# Altium schematic sheet DebugOutputs.SchDoc
size OrCAD A; SheetNumber: 2; SheetTotal: 3
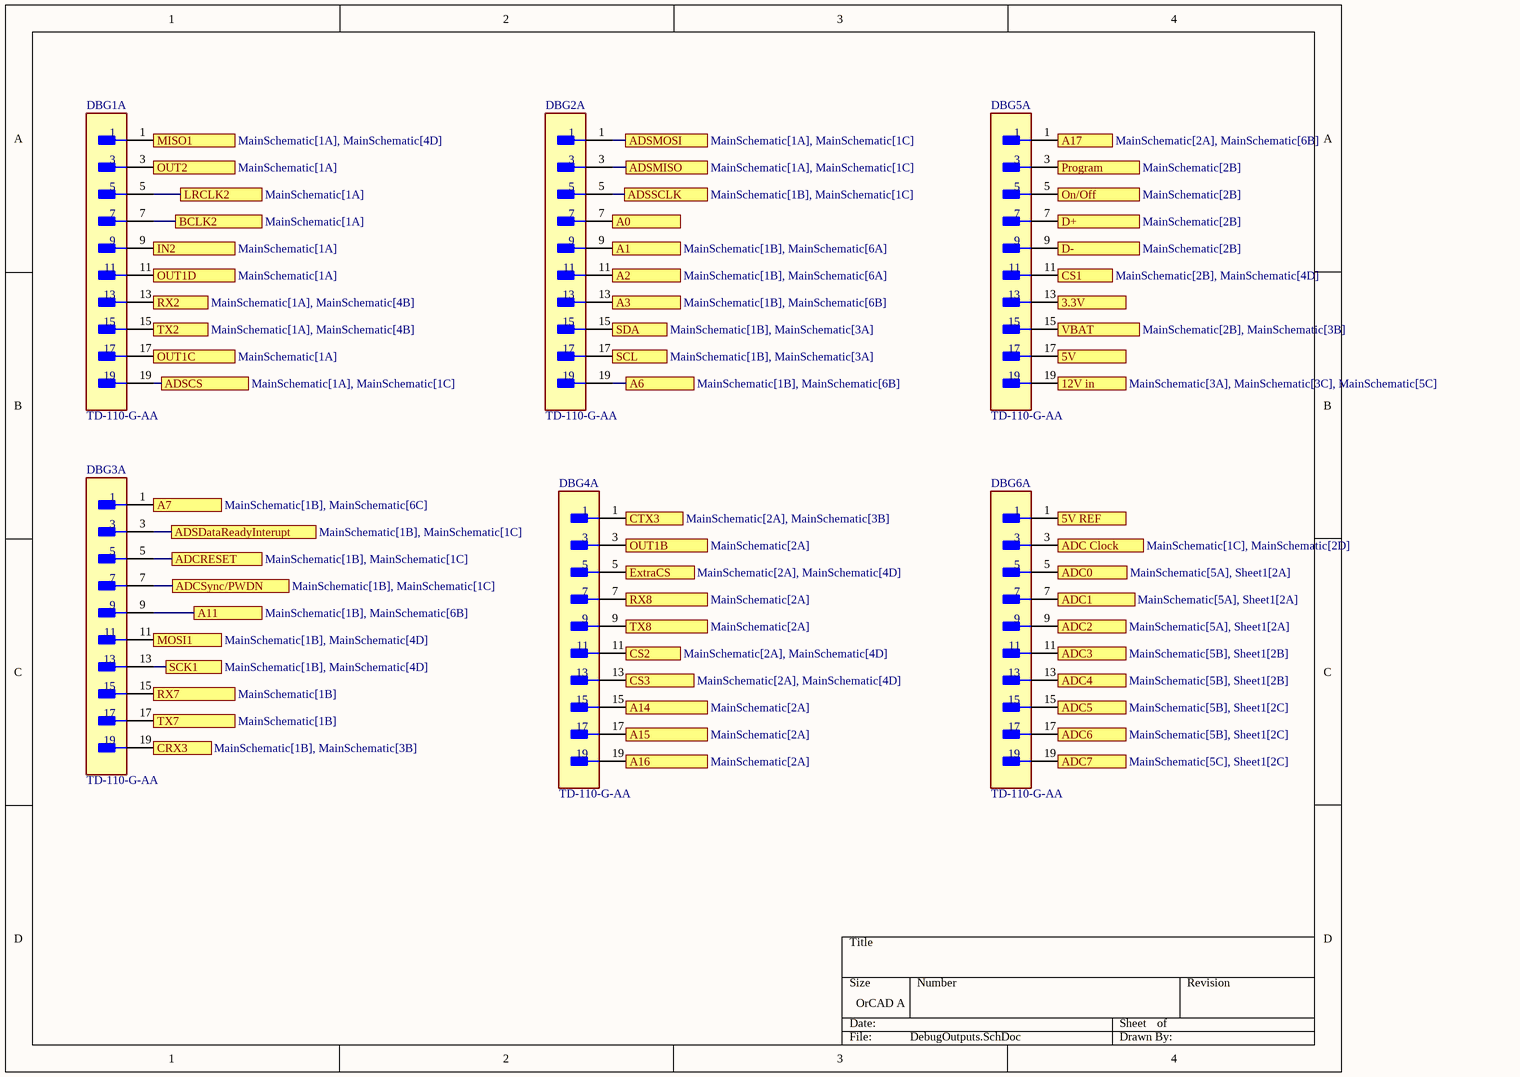
[diagram p0: DebugOutputs.SchDoc]

## Parts
DBG1  TD-110-G-AA  [FP-TD-110-G-AA-MFG]  (part A of 2)
DBG2  TD-110-G-AA  [FP-TD-110-G-AA-MFG]  (part A of 2)
DBG3  TD-110-G-AA  [FP-TD-110-G-AA-MFG]  (part A of 2)
DBG4  TD-110-G-AA  [FP-TD-110-G-AA-MFG]  (part A of 2)
DBG5  TD-110-G-AA  [FP-TD-110-G-AA-MFG]  (part A of 2)
DBG6  TD-110-G-AA  [FP-TD-110-G-AA-MFG]  (part A of 2)

## Ports
3.3V (see MainSchematic[1C], MainSchematic[1D], MainSchematic[2A], MainSchematic[3B], MainSchematic[4C]), 5V (see MainSchematic[1C], MainSchematic[2B], MainSchematic[3A], MainSchematic[4A], MainSchematic[4C], MainSchematic[4D], MainSchematic[6A], MainSchematic[6B], MainSchematic[6C]), 5V REF (see MainSchematic[2C], MainSchematic[5A], MainSchematic[5B], MainSchematic[5C], MainSchematic[6C]), 12V in (see MainSchematic[3A], MainSchematic[3C], MainSchematic[5C]), A0 (see MainSchematic[1B], MainSchematic[6A]), A1 (see MainSchematic[1B], MainSchematic[6A]), A2 (see MainSchematic[1B], MainSchematic[6A]), A3 (see MainSchematic[1B], MainSchematic[6B]), A6 (see MainSchematic[1B], MainSchematic[6B]), A7 (see MainSchematic[1B], MainSchematic[6C]), A11 (see MainSchematic[1B], MainSchematic[6B]), A14 (see MainSchematic[2A]), A15 (see MainSchematic[2A]), A16 (see MainSchematic[2A]), A17 (see MainSchematic[2A], MainSchematic[6B]), ADC0 (see MainSchematic[5A], Sheet1[2A]), ADC1 (see MainSchematic[5A], Sheet1[2A]), ADC2 (see MainSchematic[5A], Sheet1[2A]), ADC3 (see MainSchematic[5B], Sheet1[2B]), ADC4 (see MainSchematic[5B], Sheet1[2B]), ADC5 (see MainSchematic[5B], Sheet1[2C]), ADC6 (see MainSchematic[5B], Sheet1[2C]), ADC7 (see MainSchematic[5C], Sheet1[2C]), ADC Clock (see MainSchematic[1C], MainSchematic[2D]), ADCRESET (see MainSchematic[1B], MainSchematic[1C]), ADCSync/PWDN (see MainSchematic[1B], MainSchematic[1C]), ADSCS (see MainSchematic[1A], MainSchematic[1C]), ADSDataReadyInterupt (see MainSchematic[1B], MainSchematic[1C]), ADSMISO (see MainSchematic[1A], MainSchematic[1C]), ADSMOSI (see MainSchematic[1A], MainSchematic[1C]), ADSSCLK (see MainSchematic[1B], MainSchematic[1C]), BCLK2 (see MainSchematic[1A]), CRX3 (see MainSchematic[1B], MainSchematic[3B]), CS1 (see MainSchematic[2B], MainSchematic[4D]), CS2 (see MainSchematic[2A], MainSchematic[4D]), CS3 (see MainSchematic[2A], MainSchematic[4D]), CTX3 (see MainSchematic[2A], MainSchematic[3B]), D+ (see MainSchematic[2B]), D- (see MainSchematic[2B]), ExtraCS (see MainSchematic[2A], MainSchematic[4D]), IN2 (see MainSchematic[1A]), LRCLK2 (see MainSchematic[1A]), MISO1 (see MainSchematic[1A], MainSchematic[4D]), MOSI1 (see MainSchematic[1B], MainSchematic[4D]), On/Off (see MainSchematic[2B]), OUT1B (see MainSchematic[2A]), OUT1C (see MainSchematic[1A]), OUT1D (see MainSchematic[1A]), OUT2 (see MainSchematic[1A]), Program (see MainSchematic[2B]), RX2 (see MainSchematic[1A], MainSchematic[4B]), RX7 (see MainSchematic[1B]), RX8 (see MainSchematic[2A]), SCK1 (see MainSchematic[1B], MainSchematic[4D]), SCL (see MainSchematic[1B], MainSchematic[3A]), SDA (see MainSchematic[1B], MainSchematic[3A]), TX2 (see MainSchematic[1A], MainSchematic[4B]), TX7 (see MainSchematic[1B]), TX8 (see MainSchematic[2A]), VBAT (see MainSchematic[2B], MainSchematic[3B])

## Nets
3.3V: DBG5.13 ; port 3.3V
5V: DBG5.17 ; port 5V
5V REF: DBG6.1 ; port 5V REF
12V in: DBG5.19 ; port 12V in
A0: DBG2.7 ; port A0
A1: DBG2.9 ; port A1
A2: DBG2.11 ; port A2
A3: DBG2.13 ; port A3
A6: DBG2.19 ; port A6
A7: DBG3.1 ; port A7
A11: DBG3.9 ; port A11
A14: DBG4.15 ; port A14
A15: DBG4.17 ; port A15
A16: DBG4.19 ; port A16
A17: DBG5.1 ; port A17
ADC0: DBG6.5 ; port ADC0
ADC1: DBG6.7 ; port ADC1
ADC2: DBG6.9 ; port ADC2
ADC3: DBG6.11 ; port ADC3
ADC4: DBG6.13 ; port ADC4
ADC5: DBG6.15 ; port ADC5
ADC6: DBG6.17 ; port ADC6
ADC7: DBG6.19 ; port ADC7
ADC Clock: DBG6.3 ; port ADC Clock
ADCRESET: DBG3.5 ; port ADCRESET
ADCSync/PWDN: DBG3.7 ; port ADCSync/PWDN
ADSCS: DBG1.19 ; port ADSCS
ADSDataReadyInterupt: DBG3.3 ; port ADSDataReadyInterupt
ADSMISO: DBG2.3 ; port ADSMISO
ADSMOSI: DBG2.1 ; port ADSMOSI
ADSSCLK: DBG2.5 ; port ADSSCLK
BCLK2: DBG1.7 ; port BCLK2
CRX3: DBG3.19 ; port CRX3
CS1: DBG5.11 ; port CS1
CS2: DBG4.11 ; port CS2
CS3: DBG4.13 ; port CS3
CTX3: DBG4.1 ; port CTX3
D+: DBG5.7 ; port D+
D-: DBG5.9 ; port D-
ExtraCS: DBG4.5 ; port ExtraCS
IN2: DBG1.9 ; port IN2
LRCLK2: DBG1.5 ; port LRCLK2
MISO1: DBG1.1 ; port MISO1
MOSI1: DBG3.11 ; port MOSI1
On/Off: DBG5.5 ; port On/Off
OUT1B: DBG4.3 ; port OUT1B
OUT1C: DBG1.17 ; port OUT1C
OUT1D: DBG1.11 ; port OUT1D
OUT2: DBG1.3 ; port OUT2
Program: DBG5.3 ; port Program
RX2: DBG1.13 ; port RX2
RX7: DBG3.15 ; port RX7
RX8: DBG4.7 ; port RX8
SCK1: DBG3.13 ; port SCK1
SCL: DBG2.17 ; port SCL
SDA: DBG2.15 ; port SDA
TX2: DBG1.15 ; port TX2
TX7: DBG3.17 ; port TX7
TX8: DBG4.9 ; port TX8
VBAT: DBG5.15 ; port VBAT

## Library data of the parts
DBG1-DBG6 = CMP-02766-001426-1: .100" DOUBLE ROW SCREW MACHINE T; Gender: Male; Number of Contacts: 20; REACH SVHC: No SVHC; Contact Material: Brass; Termination: Through Hole; Number of Rows: 2; Contact Plating: Gold; Mount: Through Hole; Series: TD